# Altium project POWER_SUPPLY.PrjPcb (part 3 of 8)
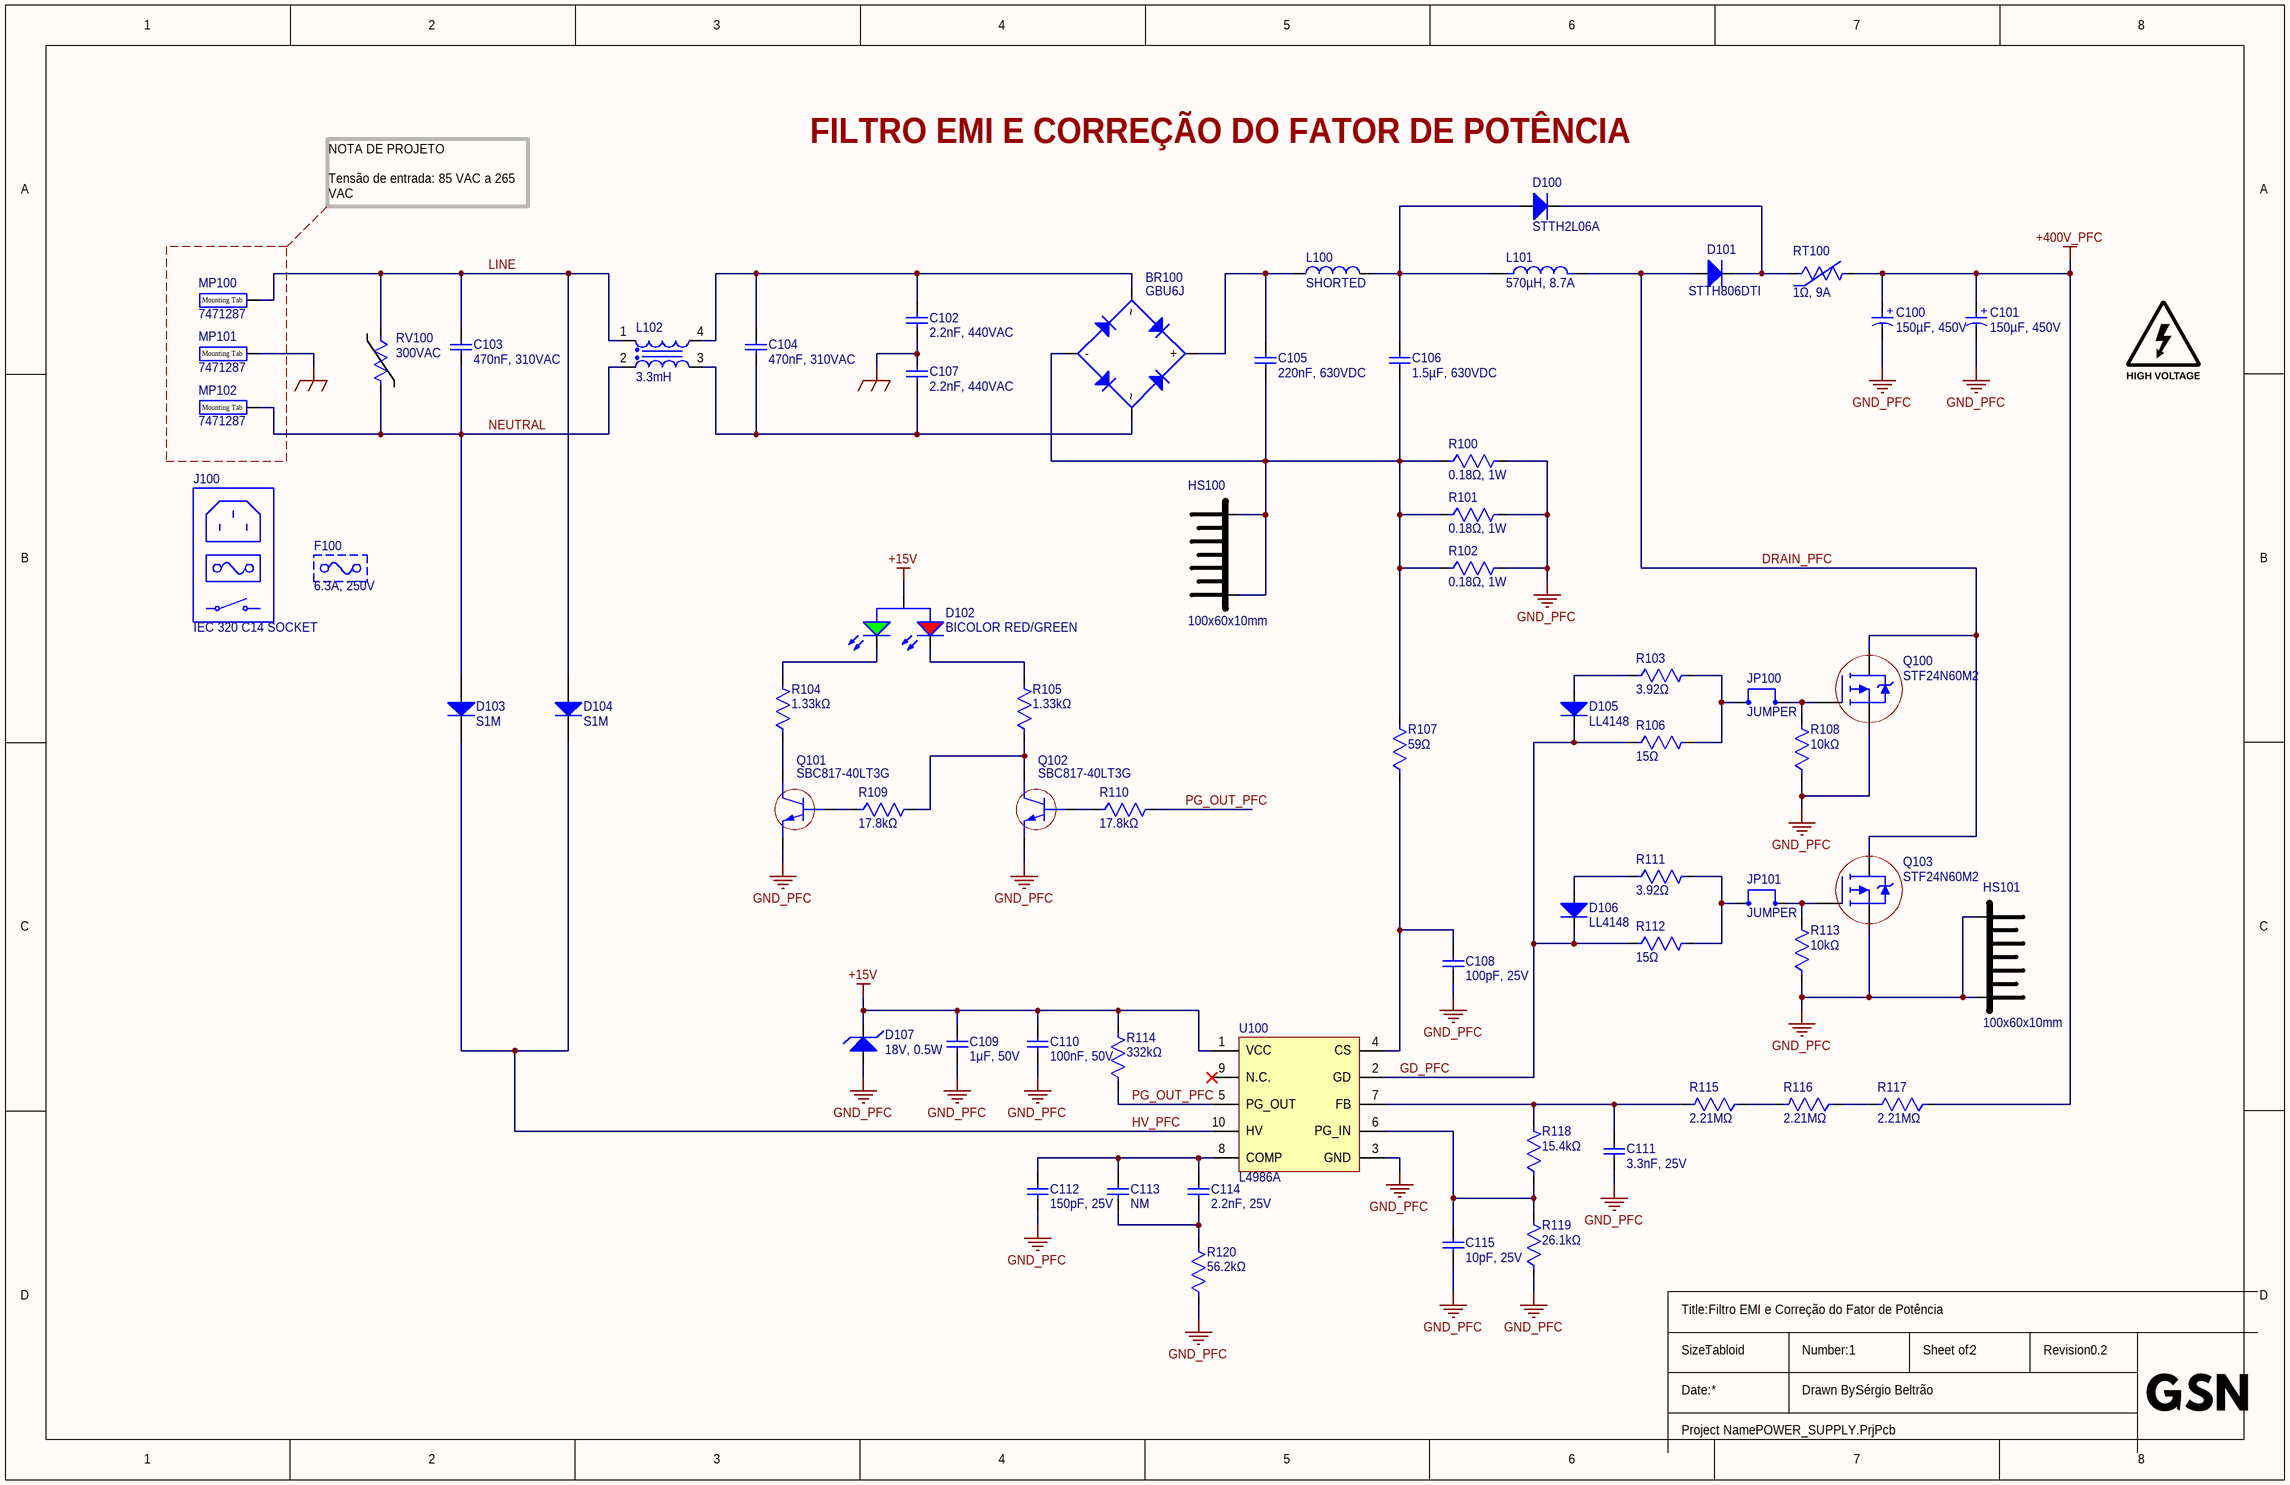
[diagram p4: 1_PFC.SchDoc]

## Sheet 1_PFC.SchDoc (continued)

### Library data of the parts (continued)
D105 D106 = LL4148: DIODE STANDARD 100V 200MA SOD80; Manufacturer: onsemi; Manufacturer Lifecycle Status: ACTIVE; Body Material: Glass; Current: 2A; Element Configuration: Single; Forward Voltage: 1V; Max Power Dissipation: 500mW; Number of Elements: 1; Peak Reverse Current: 25nA; Recovery Time: 4ns; Supplier: DigiKey; Supplier Part Number: LL4148FSCT-ND; Manufacturer Part Number: LL4148; RoHS: Compliant; Category: Rectifier Diodes; Stock: 985538; Pricing: 1=0.1, 10=0.05, 100=0.0426, 500=0.0307, 1000=0.02682 (USD); Average Rectified Current: 200mA; China RoHS: Non-Compliant; Contact Plating: Tin; Country of Origin: Mainland China; Export Control Classification Number (ECCN) Code: EAR99; Forward Current: 200mA; Height: 1.5mm; Harmonized Tariff Schedule (HTS) Code: 8541.10.00.70; Introduction Date: 2006-01-13; Lead Free: Lead Free; Length: 3.6mm; Lifecycle Status: Production; Max Forward Surge Current (Ifsm): 2A; Max Operating Temperature: 175°C; Max Output current: 200mA; Max Repetitive Reverse Voltage (Vrrm): 100V; Max Reverse Voltage (DC): 100V; Max Surge Current: 2A; Min Operating Temperature: -55°C; Mounting Technology: Surface Mount; Pins: 2; Number of Terminals: 2; Packaging: Cut Tape; Peak Non-Repetitive Surge Current: 2A; Power Dissipation: 500mW; Radiation Hardening: No; REACH SVHC: Yes; Reverse Recovery Time: 4ns; Reverse Standoff Voltage: 100V; Reverse Voltage: 100V; Schedule B: 8541100070, 8541100070|8541100070, 8541100070|8541100070|8541100070, 8541100070|8541100070|8541100070|8541100070; Voltage: 100V; Weight: 4.535924g; Width: 1.5mm; ComponentLink1URL: https://datasheet.octopart.com:443/LL4148-onsemi-datasheet-158584874.pdf?src-supplier=onsemi; ComponentLink1Description: https://datasheet.octopart.com:443/LL4148-onsemi-datasheet-158584874.pdf?src-supplier=onsemi; ComponentLink2URL: https://datasheet.octopart.com:443/LL4148-ON-Semiconductor-datasheet-85572496.pdf?src-supplier=onsemi; ComponentLink2Description: https://datasheet.octopart.com:443/LL4148-ON-Semiconductor-datasheet-85572496.pdf?src-supplier=onsemi; ComponentLink3URL: https://datasheet.octopart.com:443/LL4148-ON-Semiconductor-datasheet-86697764.pdf?src-supplier=onsemi; ComponentLink3Description: https://datasheet.octopart.com:443/LL4148-ON-Semiconductor-datasheet-86697764.pdf?src-supplier=onsemi; ComponentLink4URL: https://datasheet.octopart.com:443/LL4148-ON-Semiconductor-datasheet-17172799.pdf?src-supplier=element14+APAC; ComponentLink4Description: https://datasheet.octopart.com:443/LL4148-ON-Semiconductor-datasheet-17172799.pdf?src-supplier=element14+APAC; ComponentLink5URL: https://datasheet.octopart.com:443/LL4148-ON-Semiconductor-datasheet-86691521.pdf?src-supplier=element14+APAC; ComponentLink5Description: https://datasheet.octopart.com:443/LL4148-ON-Semiconductor-datasheet-86691521.pdf?src-supplier=element14+APAC; ComponentLink6URL: https://datasheet.octopart.com:443/LL4148-Fairchild-Semiconductor-datasheet-38581097.pdf?src-supplier=element14+APAC; ComponentLink6Description: https://datasheet.octopart.com:443/LL4148-Fairchild-Semiconductor-datasheet-38581097.pdf?src-supplier=element14+APAC; ComponentLink7URL: https://datasheet.octopart.com:443/LL4148-Fairchild-Semiconductor-datasheet-62114946.pdf?src-supplier=element14+APAC; ComponentLink7Description: https://datasheet.octopart.com:443/LL4148-Fairchild-Semiconductor-datasheet-62114946.pdf?src-supplier=element14+APAC; ComponentLink8URL: https://datasheet.octopart.com:443/LL4148-Fairchild-Semiconductor-datasheet-62292353.pdf?src-supplier=element14+APAC; ComponentLink8Description: https://datasheet.octopart.com:443/LL4148-Fairchild-Semiconductor-datasheet-62292353.pdf?src-supplier=element14+APAC; ComponentLink9URL: https://datasheet.octopart.com:443/LL4148.-ON-Semiconductor-datasheet-87455466.pdf?src-supplier=element14+APAC; ComponentLink9Description: https://datasheet.octopart.com:443/LL4148.-ON-Semiconductor-datasheet-87455466.pdf?src-supplier=element14+APAC; ComponentLink10URL: https://datasheet.octopart.com:443/LL4148-ON-Semiconductor-datasheet-100088444.pdf?src-supplier=JRH+Electronics; ComponentLink10Description: https://datasheet.octopart.com:443/LL4148-ON-Semiconductor-datasheet-100088444.pdf?src-supplier=JRH+Electronics; ComponentLink11URL: https://datasheet.octopart.com:443/LL4148-onsemi-datasheet-180961323.pdf?src-supplier=IHS; ComponentLink11Description: https://datasheet.octopart.com:443/LL4148-onsemi-datasheet-180961323.pdf?src-supplier=IHS; ComponentLink12URL: https://datasheet.octopart.com:443/LL4148-Fairchild-Semiconductor-datasheet-182297807.pdf?src-supplier=IHS; ComponentLink12Description: https://datasheet.octopart.com:443/LL4148-Fairchild-Semiconductor-datasheet-182297807.pdf?src-supplier=IHS; ComponentLink13URL: https://datasheet.octopart.com:443/LL4148-Fairchild-datasheet-492438.pdf?src-supplier=Fairchild+Semiconductor; ComponentLink13Description: https://datasheet.octopart.com:443/LL4148-Fairchild-datasheet-492438.pdf?src-supplier=Fairchild+Semiconductor; ComponentLink14URL: https://datasheet.octopart.com:443/LL4148-Fairchild-Semiconductor-datasheet-11045226.pdf?src-supplier=Fairchild+Semiconductor; ComponentLink14Description: https://datasheet.octopart.com:443/LL4148-Fairchild-Semiconductor-datasheet-11045226.pdf?src-supplier=Fairchild+Semiconductor; ComponentLink15URL: https://sigma.octopart.com:443/17344539/technical_drawing/Fairchild-Semiconductor-LL4148.pdf?src-supplier=Fairchild+Semiconductor; ComponentLink15Description: https://sigma.octopart.com:443/17344539/technical_drawing/Fairchild-Semiconductor-LL4148.pdf?src-supplier=Fairchild+Semiconductor; ComponentLink16URL: https://datasheet.octopart.com:443/LL4148-Fairchild-Semiconductor-datasheet-14041796.pdf?src-supplier=iiiC; ComponentLink16Description: https://datasheet.octopart.com:443/LL4148-Fairchild-Semiconductor-datasheet-14041796.pdf?src-supplier=iiiC; ComponentLink17URL: https://datasheet.octopart.com:443/LL4148-Fairchild-Semiconductor-datasheet-10438456.pdf?src-supplier=Jameco; ComponentLink17Description: https://datasheet.octopart.com:443/LL4148-Fairchild-Semiconductor-datasheet-10438456.pdf?src-supplier=Jameco; ComponentLink18URL: https://datasheet.octopart.com:443/LL4148-ON-Semiconductor-datasheet-81454985.pdf?src-supplier=TME; ComponentLink18Description: https://datasheet.octopart.com:443/LL4148-ON-Semiconductor-datasheet-81454985.pdf?src-supplier=TME; ComponentLink19URL: https://datasheet.octopart.com:443/LL4148-Fairchild-Semiconductor-datasheet-62139678.pdf?src-supplier=iodParts+Technologies+Inc.; ComponentLink19Description: https://datasheet.octopart.com:443/LL4148-Fairchild-Semiconductor-datasheet-62139678.pdf?src-supplier=iodParts+Technologies+Inc.; ComponentLink20URL: https://datasheet.octopart.com:443/LL4148-Fairchild-Semiconductor-datasheet-62268912.pdf?src-supplier=Newark; ComponentLink20Description: https://datasheet.octopart.com:443/LL4148-Fairchild-Semiconductor-datasheet-62268912.pdf?src-supplier=Newark; ComponentLink21URL: http://sigma.octopart.com:80/150613095/rohs_statement/ON-Semiconductor-LL4148.pdf?src-supplier=Compliance+Statements; ComponentLink21Description: http://sigma.octopart.com:80/150613095/rohs_statement/ON-Semiconductor-LL4148.pdf?src-supplier=Compliance+Statements; ComponentLink22URL: http://sigma.octopart.com:80/17353531/reach_statement/Fairchild-Semiconductor-LL4148.pdf?src-supplier=Compliance+Statements; ComponentLink22Description: http://sigma.octopart.com:80/17353531/reach_statement/Fairchild-Semiconductor-LL4148.pdf?src-supplier=Compliance+Statements; ComponentLink23URL: http://sigma.octopart.com:80/17353532/materials_sheet/Fairchild-Semiconductor-LL4148.pdf?src-supplier=Compliance+Statements; ComponentLink23Description: http://sigma.octopart.com:80/17353532/materials_sheet/Fairchild-Semiconductor-LL4148.pdf?src-supplier=Compliance+Statements; ComponentLink24URL: http://sigma.octopart.com:80/33193297/reach_statement/Fairchild-Semiconductor-LL4148.pdf?src-supplier=Compliance+Statements; ComponentLink24Description: http://sigma.octopart.com:80/33193297/reach_statement/Fairchild-Semiconductor-LL4148.pdf?src-supplier=Compliance+Statements; ComponentLink25URL: http://sigma.octopart.com:80/33193298/materials_sheet/Fairchild-Semiconductor-LL4148.pdf?src-supplier=Compliance+Statements; ComponentLink25Description: http://sigma.octopart.com:80/33193298/materials_sheet/Fairchild-Semiconductor-LL4148.pdf?src-supplier=Compliance+Statements; ComponentLink26URL: http://sigma.octopart.com:80/reach_statement/ON-Semiconductor-company-79.pdf?src-supplier=Compliance+Statements; ComponentLink26Description: http://sigma.octopart.com:80/reach_statement/ON-Semiconductor-company-79.pdf?src-supplier=Compliance+Statements; ComponentLink27URL: http://sigma.octopart.com:80/rohs_statement/Fairchild-Semiconductor-company-11.pdf?src-supplier=Compliance+Statements; ComponentLink27Description: http://sigma.octopart.com:80/rohs_statement/Fairchild-Semiconductor-company-11.pdf?src-supplier=Compliance+Statements; ComponentLink28URL: http://sigma.octopart.com:80/rohs_statement/Fairchild-Semiconductor-company-10.pdf?src-supplier=Compliance+Statements; ComponentLink28Description: http://sigma.octopart.com:80/rohs_statement/Fairchild-Semiconductor-company-10.pdf?src-supplier=Compliance+Statements; ComponentLink29URL: http://sigma.octopart.com:80/reach_statement/Fairchild-Semiconductor-company-9.pdf?src-supplier=Compliance+Statements; ComponentLink29Description: http://sigma.octopart.com:80/reach_statement/Fairchild-Semiconductor-company-9.pdf?src-supplier=Compliance+Statements; ComponentLink30URL: https://octopart.com:443/opatz8j6/c1?t=Xpxkz2NEgx4OvPA3Qtyl6iXlCaTO6Dx006tOayOQh8UpEakiw79qybXVjaLUkLdsDcwAhzZWzx4hsVWPp7VVSRUS2jTBS-XM3DH5FBRSfylGBMniz7AQVr_Q7R3Jx2l4jaOKMfh2pC0Sl6mKcG5iyxqYHFtscphSICSNicIjKzxGRZvfLlKmxXOW-H294Yk1x_cmMiAGYKmeAx8dFNplOshOoCdbbUeOktIk3E71qjxJoHCVKROfEgPEuVAOotDk7D3GLFhb0ONIF7lvGKCN4-I4pNAMnSjDC8dGdI9FUWqMmgWXOVngnCQl4h9fXjZD62hPSik3c7L-oytIjEzlRkn8LqxphGg_pA&src-supplier=Compliance+Statements; ComponentLink30Description: https://octopart.com:443/opatz8j6/c1?t=Xpxkz2NEgx4OvPA3Qtyl6iXlCaTO6Dx006tOayOQh8UpEakiw79qybXVjaLUkLdsDcwAhzZWzx4hsVWPp7VVSRUS2jTBS-XM3DH5FBRSfylGBMniz7AQVr_Q7R3Jx2l4jaOKMfh2pC0Sl6mKcG5iyxqYHFtscphSICSNicIjKzxGRZvfLlKmxXOW-H294Yk1x_cmMiAGYKmeAx8dFNplOshOoCdbbUeOktIk3E71qjxJoHCVKROfEgPEuVAOotDk7D3GLFhb0ONIF7lvGKCN4-I4pNAMnSjDC8dGdI9FUWqMmgWXOVngnCQl4h9fXjZD62hPSik3c7L-oytIjEzlRkn8LqxphGg_pA&src-supplier=Compliance+Statements; ComponentLink31URL: https://octopart.com:443/opatz8j6/c1?t=tFIoAttQBStIyOR12NpmeKiMmTe5SP8-8Xq4lkvK6p_Vq1o_9olfxB33t-2EuHG15KFq_ggm6QlYiEY221wMJCkD3umFHElGgHs0hHZS39-Qp2ZZRsupO9Hr1N3PAdDpe750FQU0XgmhgEwHMZn8Z3k5HuoWmRNpRKEnkRFrE0IXKj6CmvQTfQmsENA-D1Qdyo8uqC6uxEsjmMW0Z_q8gXSjLM0_5fRz8eR6DFUS172wwd2S-tXcH_fY0j82uyAjy2XTX7JZakjtcfcCauvyxulJf2m4Pvazm22R5r_wpz6eRhj7z7PQ5lP7HSMDztpbFG7UgPSC_-QkyDNCFsHVILyjtZbhab6GOQU&src-supplier=Compliance+Statements; ComponentLink31Description: https://octopart.com:443/opatz8j6/c1?t=tFIoAttQBStIyOR12NpmeKiMmTe5SP8-8Xq4lkvK6p_Vq1o_9olfxB33t-2EuHG15KFq_ggm6QlYiEY221wMJCkD3umFHElGgHs0hHZS39-Qp2ZZRsupO9Hr1N3PAdDpe750FQU0XgmhgEwHMZn8Z3k5HuoWmRNpRKEnkRFrE0IXKj6CmvQTfQmsENA-D1Qdyo8uqC6uxEsjmMW0Z_q8gXSjLM0_5fRz8eR6DFUS172wwd2S-tXcH_fY0j82uyAjy2XTX7JZakjtcfcCauvyxulJf2m4Pvazm22R5r_wpz6eRhj7z7PQ5lP7HSMDztpbFG7UgPSC_-QkyDNCFsHVILyjtZbhab6GOQU&src-supplier=Compliance+Statements
D107 = ZMM18B: DIODE ZENER 18V 500MW SOD80C; Manufacturer: Diotec; Manufacturer Lifecycle Status: ACTIVE; Body Material: Glass; Impedance: 50Ω; Number of Elements: 1; Peak Reverse Current: 100nA; Polarity: Unidirectional; Reverse Standoff Voltage: 13V; Voltage Tolerance: 2%; Zener Current: 5mA; Supplier: DigiKey; Supplier Part Number: 4878-ZMM18B-ND; Manufacturer Part Number: ZMM18B; RoHS: Compliant; Category: Zener Diodes; Stock: 2500; Pricing: 1=0.18, 10=0.108, 100=0.0823, 500=0.07154, 1000=0.042, 2500=0.04116 (USD); Country of Origin: Mainland China; Export Control Classification Number (ECCN) Code: EAR99; Harmonized Tariff Schedule (HTS) Code: 85411000; Introduction Date: 2005-07-18; Lifecycle Status: Production; Max Operating Temperature: 175°C; Max Power Dissipation: 500mW; Min Operating Temperature: -50°C; Number of Terminals: 2; REACH SVHC: Unknown; Reference Voltage: 18V; Weight: 49mg; ComponentLink1URL: https://datasheet.octopart.com:443/ZMM18B-Diotec-datasheet-168810322.pdf?src-supplier=IHS; ComponentLink1Description: https://datasheet.octopart.com:443/ZMM18B-Diotec-datasheet-168810322.pdf?src-supplier=IHS; ComponentLink2URL: https://datasheet.octopart.com:443/ZMM18B-Diotec-datasheet-20772213.pdf?src-supplier=Component+Distributors+Inc.; ComponentLink2Description: https://datasheet.octopart.com:443/ZMM18B-Diotec-datasheet-20772213.pdf?src-supplier=Component+Distributors+Inc.; ComponentLink3URL: https://datasheet.octopart.com:443/ZMM18B-Diotec-datasheet-113245526.pdf?src-supplier=TME; ComponentLink3Description: https://datasheet.octopart.com:443/ZMM18B-Diotec-datasheet-113245526.pdf?src-supplier=TME; ComponentLink4URL: https://datasheet.octopart.com:443/ZMM18B-Diotec-datasheet-177062540.pdf?src-supplier=Burklin+Elektronik; ComponentLink4Description: https://datasheet.octopart.com:443/ZMM18B-Diotec-datasheet-177062540.pdf?src-supplier=Burklin+Elektronik
F100 = 0652C6300-11: FUSE GLASS 6.3A 250VAC 5X20MM; Manufacturer: Bel Fuse; Supplier: DigiKey; Supplier Part Number: 5923-0652C6300-11-ND; Manufacturer Part Number: 0652C6300-11; RoHS: Compliant; Category: Fuses; Stock: 939; Pricing: 1=0.7, 5=0.578, 10=0.533, 50=0.4422, 100=0.408, 250=0.36672, 500=0.33824, 1000=0.31188, 5000=0.25785 (USD); China RoHS: Compliant; Current Rating: 6.3A; Export Control Classification Number (ECCN) Code: EAR99; Height: 20mm; Introduction Date: 2024-09-20; Length: 5mm; Lifecycle Status: Production; Max Operating Temperature: 125°C; Min Operating Temperature: -55°C; Packaging: Bulk; REACH SVHC: Yes; Voltage Rating (AC): 250V; ComponentLink1URL: https://datasheet.octopart.com:443/0652C6300-11-Bel-Fuse-datasheet-183197481.pdf?src-supplier=Electro+Sonic; ComponentLink1Description: https://datasheet.octopart.com:443/0652C6300-11-Bel-Fuse-datasheet-183197481.pdf?src-supplier=Electro+Sonic
GRPH100 = DANGER HIGH VOLTAGE ICON: GRAPHIC ICON
HS100 HS101 = GENERIC-HEATSINK-100X60X10MM: GENERIC HEATSINK 100X60X10MM; Manufacturer: OEM; Manufacturer Part Number: None
J100 = AC-01B-1: Manufacturer: OEM; Manufacturer Part Number: AC-01B-1
JP100 JP101 = JUMPER-TX-8P2X1P5MM-WHITE: JUMPER SMD TX 8.2X1.5MM WHITE; Manufacturer: OEM; Manufacturer Part Number: None
L100 = 7447070: WE-FI THT Leaded Toroidal Line Choke, 100uH, 6A, 0.035Ohm; Manufacturer: Wurth Elektronik; Manufacturer Part Number: 7447070; Category: Filter Chokes; Match Code: WE-FI; ComponentLink1Description: Website Link; ComponentLink1URL: https://www.we-online.com/redexpert/article/7447070?ad; ComponentLink2Description: Datasheet Link; ComponentLink2URL: https://www.we-online.com/redexpert/spec/7447070?ad; Mount: Through Hole; Operating Temperature Min: -40°C; Operating Temperature Max: 105°C; Packaging: Tray; Length: 25mm; Width: 11.5mm; Height: 25mm; DC Resistance Max: 0.035Ohm; Inductance: 100uH; Rated Current: 6A
L101 = MMTR014901: FIXED IND 570UH 8.7A 65MOHM KOOL MU CORE; Manufacturer: Legrand; Value: 570µH; Supplier: Display Max Eletrônica; Manufacturer Part Number: MMTR014901
L102 = 7448256033: WE-CMB Common Mode Power Line Choke, THT, Type XL, 3.3mH, 6A, 25mΩ; Manufacturer: Wurth Elektronik; Case/Size Code: Type XL; Insulation Test Voltage: 1500VAC; Material: MnZn; Rated Voltage (AC): 250V; Manufacturer Part Number: 7448256033; Category: Common Mode Chokes; Match Code: WE-CMB; ComponentLink1Description: Website Link; ComponentLink1URL: https://www.we-online.com/redexpert/article/7448256033?ad; ComponentLink2Description: Datasheet Link; ComponentLink2URL: https://www.we-online.com/redexpert/spec/7448256033?ad; Mount: Through Hole; Operating Temperature Min: -40°C; Operating Temperature Max: 125°C; Packaging: Carton; Length: 30mm; Width: 21mm; Height: 35mm; DC Resistance Max: 25mΩ; Inductance: 3.3mH; Rated Current: 6A
MP100-MP102 = 7471287: WA-MTAB Mounting Tab, THT, Vertical, Male, Blade 6.35mm; Manufacturer: Wurth Elektronik; Manufacturer Part Number: 7471287; Category: Mounting Tabs; Match Code: WA-MTAB; ComponentLink1Description: Website Link; ComponentLink1URL: https://www.we-online.com/redexpert/article/7471287?ad; ComponentLink2Description: Datasheet Link; ComponentLink2URL: https://www.we-online.com/redexpert/spec/7471287?ad; Mount: Through Hole; Operating Temperature Min: -55°C; Operating Temperature Max: 150°C; Packaging: Bag; Blade Design: 6.35mm; Gender: Male; Orientation: Vertical
Q100 Q103 = STF24N60M2: MOSFET N-CH 600V 18A TO220FP; Manufacturer: STMicroelectronics; Drain to Source Resistance: 190mΩ; Element Configuration: Single; Fall Time: 61ns; Gate to Source Voltage (Vgs): 25V; Input Capacitance: 1.06nF; Max Power Dissipation: 30W; Number of Elements: 1; Rise Time: 9ns; Turn-Off Delay Time: 60ns; Turn-On Delay Time: 14ns; Supplier: DigiKey; Supplier Part Number: 497-13577-5-ND; Manufacturer Part Number: STF24N60M2; RoHS: Compliant; Category: MOSFETs; Stock: 871; Pricing: 1=3.33, 50=1.6716, 100=1.5103, 500=1.22756, 1000=1.13672, 2000=1.06037, 5000=1.05788 (USD); Case/Package: TO-220-3; China RoHS: Non-Compliant; Continuous Drain Current (ID): 18A; Country of Origin: Mainland China; Drain to Source Breakdown Voltage: 600V; Drain to Source Voltage (Vdss): 600V; Export Control Classification Number (ECCN) Code: EAR99; Height: 16.4mm; Introduction Date: 2013-01-14; Lead Free: Lead Free; Length: 10.4mm; Lifecycle Status: Production; Max Operating Temperature: 150°C; Min Breakdown Voltage: 600V; Min Operating Temperature: -55°C; Mounting Technology: Through Hole; Pins: 3; Number of Terminals: 3; Power Dissipation: 30W; Radiation Hardening: No; Rds On Max: 190mΩ; REACH SVHC: No; Schedule B: 8541290080, 8541290080|8541290080|8541290080|8541290080|8541290080|8541290080|8541290080|8541290080|8541290080|8541290080|8541290080|8541290080|8541290080|8541290080|8541290080|8541290080|8541290080|8541290080|8541290080|8541290080|8541290080|8541290080|8541290080|85; Width: 4.6mm; ComponentLink1URL: https://datasheet.octopart.com:443/STF24N60M2-STMicroelectronics-datasheet-62336145.pdf?src-supplier=Farnell; ComponentLink1Description: https://datasheet.octopart.com:443/STF24N60M2-STMicroelectronics-datasheet-62336145.pdf?src-supplier=Farnell; ComponentLink2URL: https://datasheet.octopart.com:443/STF24N60M2-STMicroelectronics-datasheet-16349054.pdf?src-supplier=Future+Electronics; ComponentLink2Description: https://datasheet.octopart.com:443/STF24N60M2-STMicroelectronics-datasheet-16349054.pdf?src-supplier=Future+Electronics; ComponentLink3URL: https://datasheet.octopart.com:443/STF24N60M2-STMicroelectronics-datasheet-62335173.pdf?src-supplier=TME; ComponentLink3Description: https://datasheet.octopart.com:443/STF24N60M2-STMicroelectronics-datasheet-62335173.pdf?src-supplier=TME
Q101 Q102 = SBC817-40LT3G: TRANS NPN 45V 0.5A SOT23-3; Manufacturer: onsemi; Manufacturer Lifecycle Status: ACTIVE; Collector Base Voltage (VCBO): 50V; Continuous Collector Current: 500mA; Element Configuration: Single; Emitter Base Voltage (VEBO): 5V; Frequency: 100MHz; hFE Min: 250; Max Power Dissipation: 300mW; Number of Elements: 1; Supplier: DigiKey; Supplier Part Number: SBC817-40LT3GOSCT-ND; Manufacturer Part Number: SBC817-40LT3G; RoHS: Compliant; Category: BJTs; Stock: 144045; Pricing: 1=0.24, 10=0.146, 100=0.0904, 500=0.06616, 1000=0.05829, 2000=0.05165, 5000=0.04443 (USD); Case/Package: SOT-23-3; China RoHS: Compliant; Collector Emitter Breakdown Voltage: 45V; Collector Emitter Voltage (VCEO): 45V; Country of Origin: Mainland China; Export Control Classification Number (ECCN) Code: EAR99; Halogen Free: Halogen Free; Introduction Date: 1991-03-01; Lead Free: Lead Free; Lifecycle Status: Production; Max Breakdown Voltage: 45V; Max Collector Current: 500mA; Clock Frequency: 100MHz; Max Operating Temperature: 150°C; Min Operating Temperature: -55°C; Pins: 3; Number of Terminals: 3; Packaging: Tape and Reel; Polarity: NPN; Power Dissipation: 300mW; Radiation Hardening: No; REACH SVHC: Yes; Schedule B: 8541210080, 8541210080|8541210080, 8541210080|8541210080|8541210080, 8541210080|8541210080|8541210080|8541210080; Transition Frequency: 100MHz; ComponentLink1URL: https://datasheet.octopart.com:443/SBC817-40LT3G-onsemi-datasheet-175914671.pdf?src-supplier=IHS; ComponentLink1Description: https://datasheet.octopart.com:443/SBC817-40LT3G-onsemi-datasheet-175914671.pdf?src-supplier=IHS; ComponentLink2URL: https://datasheet.octopart.com:443/SBC817-40LT3G-ON-Semiconductor-datasheet-11547464.pdf?src-supplier=Upverter; ComponentLink2Description: https://datasheet.octopart.com:443/SBC817-40LT3G-ON-Semiconductor-datasheet-11547464.pdf?src-supplier=Upverter; ComponentLink3URL: https://datasheet.octopart.com:443/SBC817-40LT3G-ON-Semiconductor-datasheet-78758879.pdf?src-supplier=Master+Electronics; ComponentLink3Description: https://datasheet.octopart.com:443/SBC817-40LT3G-ON-Semiconductor-datasheet-78758879.pdf?src-supplier=Master+Electronics; ComponentLink4URL: https://datasheet.octopart.com:443/SBC817-40LT3G-onsemi-datasheet-189132499.pdf?src-supplier=Master+Electronics; ComponentLink4Description: https://datasheet.octopart.com:443/SBC817-40LT3G-onsemi-datasheet-189132499.pdf?src-supplier=Master+Electronics; ComponentLink5URL: https://datasheet.octopart.com:443/SBC817-40LT3G-ON-Semiconductor-datasheet-8110464.pdf?src-supplier=onsemi; ComponentLink5Description: https://datasheet.octopart.com:443/SBC817-40LT3G-ON-Semiconductor-datasheet-8110464.pdf?src-supplier=onsemi; ComponentLink6URL: https://datasheet.octopart.com:443/SBC817-40LT3G-ON-Semiconductor-datasheet-6400296.pdf?src-supplier=onsemi; ComponentLink6Description: https://datasheet.octopart.com:443/SBC817-40LT3G-ON-Semiconductor-datasheet-6400296.pdf?src-supplier=onsemi; ComponentLink7URL: https://datasheet.octopart.com:443/SBC817-40LT3G-onsemi-datasheet-133521192.pdf?src-supplier=TME; ComponentLink7Description: https://datasheet.octopart.com:443/SBC817-40LT3G-onsemi-datasheet-133521192.pdf?src-supplier=TME; ComponentLink8URL: http://sigma.octopart.com:80/15540786/rohs_certificate/ON-Semiconductor-SBC817-40LT3G.pdf?src-supplier=Compliance+Statements; ComponentLink8Description: http://sigma.octopart.com:80/15540786/rohs_certificate/ON-Semiconductor-SBC817-40LT3G.pdf?src-supplier=Compliance+Statements; ComponentLink9URL: http://sigma.octopart.com:80/15684525/materials_sheet/ON-Semiconductor-SBC817-40LT3G.csv?src-supplier=Compliance+Statements; ComponentLink9Description: http://sigma.octopart.com:80/15684525/materials_sheet/ON-Semiconductor-SBC817-40LT3G.csv?src-supplier=Compliance+Statements; ComponentLink10URL: http://sigma.octopart.com:80/150631289/rohs_statement/ON-Semiconductor-SBC817-40LT3G.pdf?src-supplier=Compliance+Statements; ComponentLink10Description: http://sigma.octopart.com:80/150631289/rohs_statement/ON-Semiconductor-SBC817-40LT3G.pdf?src-supplier=Compliance+Statements; ComponentLink11URL: http://sigma.octopart.com:80/reach_statement/ON-Semiconductor-company-79.pdf?src-supplier=Compliance+Statements; ComponentLink11Description: http://sigma.octopart.com:80/reach_statement/ON-Semiconductor-company-79.pdf?src-supplier=Compliance+Statements; ComponentLink12URL: https://octopart.com:443/opatz8j6/c1?t=cEC30QwZsyb0x-FMX1jhecc8cj0lODbyQVaJL5I4EOudI-i4uiyo8QJe7x8WGpb_UfldyhXdI6wTsOpeJ5HWz7Kzleo1EiYpUhSwBawIenFlUCJsMQESd9nlIcVrbvWrabnb6HpXCtvxDkswRDKZDOG3MBWymJDy-mDPZ7u5UlptsX8-ONvWANeBowi-w7nz9iZWLyjqVoM_QTKEQgTILpDidA8CXVyMync_ukwLaadxciX7hbgDafM4N20bPQPEg7z2Sm1KwG15cEibpJqtQ1hKuQpn-edZc_o2ddvdnsTvT3gddPA_45tVxaNa9XWOJj00WFdTbgFSlU6TTFEybWVRRlK52823bHwN5uVZ-7M&src-supplier=Compliance+Statements; ComponentLink12Description: https://octopart.com:443/opatz8j6/c1?t=cEC30QwZsyb0x-FMX1jhecc8cj0lODbyQVaJL5I4EOudI-i4uiyo8QJe7x8WGpb_UfldyhXdI6wTsOpeJ5HWz7Kzleo1EiYpUhSwBawIenFlUCJsMQESd9nlIcVrbvWrabnb6HpXCtvxDkswRDKZDOG3MBWymJDy-mDPZ7u5UlptsX8-ONvWANeBowi-w7nz9iZWLyjqVoM_QTKEQgTILpDidA8CXVyMync_ukwLaadxciX7hbgDafM4N20bPQPEg7z2Sm1KwG15cEibpJqtQ1hKuQpn-edZc_o2ddvdnsTvT3gddPA_45tVxaNa9XWOJj00WFdTbgFSlU6TTFEybWVRRlK52823bHwN5uVZ-7M&src-supplier=Compliance+Statements; ComponentLink13URL: https://octopart.com:443/opatz8j6/c1?t=zgMoQUE-FAGizIL2uNADbP3CQfJXduVKNLOt0cT-C7XNOnl5EOgq1b4UVzb0SZjomH3a3CKF513mPEsnVuWFTldNModuoiOAROM-U7UMjU1TiA4JeYDoVNfia-psQDQPr2NtqLaOU9Ju06PrsXVFYjz3NjgsSVJa-5X9CcWQ1HPxPGGUjhKccWy9QJVPTcefUdorkFOZvdb3XFmpP_42jgzyR9ZUQAURqjwANTg96Z5ittV_NTML0IEyFPhh0jLh0am3ICJpb8VA9ph6AsqLc9j4fhdilqUiQTpG4UGLijUcgX0mpfEUR-9G0JRIiKjoFhJPWB3BEKd5JcwsK41biiNJ-0hjTcgtgsqlWYFFTPLS&src-supplier=Compliance+Statements; ComponentLink13Description: https://octopart.com:443/opatz8j6/c1?t=zgMoQUE-FAGizIL2uNADbP3CQfJXduVKNLOt0cT-C7XNOnl5EOgq1b4UVzb0SZjomH3a3CKF513mPEsnVuWFTldNModuoiOAROM-U7UMjU1TiA4JeYDoVNfia-psQDQPr2NtqLaOU9Ju06PrsXVFYjz3NjgsSVJa-5X9CcWQ1HPxPGGUjhKccWy9QJVPTcefUdorkFOZvdb3XFmpP_42jgzyR9ZUQAURqjwANTg96Z5ittV_NTML0IEyFPhh0jLh0am3ICJpb8VA9ph6AsqLc9j4fhdilqUiQTpG4UGLijUcgX0mpfEUR-9G0JRIiKjoFhJPWB3BEKd5JcwsK41biiNJ-0hjTcgtgsqlWYFFTPLS&src-supplier=Compliance+Statements
R100-R102 = RL2512FK-070R18L: RES 0.18 OHM 1% 1W 2512; Manufacturer: Yageo Group; Value: 180mΩ; Temperature Coefficient: 600ppm/°C; Working Voltage: 424.3mV; Supplier: DigiKey; Supplier Part Number: 311-0.18TCT-ND; Manufacturer Part Number: RL2512FK-070R18L; RoHS: Compliant; Category: Chip SMD Resistors; Stock: 7929; Pricing: 1=0.44, 10=0.249, 25=0.206, 50=0.1814, 100=0.1618, 250=0.142, 500=0.13056, 1000=0.12148 (USD); Case/Package: 2512; Case Code (Imperial): 2512; Case Code (Metric): 6332; China RoHS: Non-Compliant; Composition: Thick Film; Contact Plating: Tin; Depth: 3.2mm; Height: 550µm; Lead Free: Lead Free; Length: 6.35mm; Lifecycle Status: Production; Max Operating Temperature: 155°C; Military Standard: Not; Min Operating Temperature: -55°C; Mounting Technology: Surface Mount; Number of Terminals: 2; Packaging: Cut Tape; Power Rating: 1W; Radiation Hardening: No; Ratings: AEC-Q200; REACH SVHC: Yes; Schedule B: 8533210045, 8533210045|8533210045, 8533210045|8533210045|8533210045, 8533210045|8533210045|8533210045|8533210045; Termination: SMD/SMT; Tolerance: 1%; Weight: 40.511469mg; Width: 3.2mm; ComponentLink1URL: https://datasheet.octopart.com:443/RL2512FK-070R18L-Yageo-datasheet-182189623.pdf?src-supplier=Newark; ComponentLink1Description: https://datasheet.octopart.com:443/RL2512FK-070R18L-Yageo-datasheet-182189623.pdf?src-supplier=Newark; ComponentLink2URL: https://datasheet.octopart.com:443/RL2512FK-070R18L-Yageo-datasheet-8324393.pdf?src-supplier=Newark; ComponentLink2Description: https://datasheet.octopart.com:443/RL2512FK-070R18L-Yageo-datasheet-8324393.pdf?src-supplier=Newark; ComponentLink3URL: https://datasheet.octopart.com:443/RL2512FK-070R18L-Yageo-datasheet-62330055.pdf?src-supplier=element14+APAC; ComponentLink3Description: https://datasheet.octopart.com:443/RL2512FK-070R18L-Yageo-datasheet-62330055.pdf?src-supplier=element14+APAC; ComponentLink4URL: https://datasheet.octopart.com/RL2512FK-070R18L-Yageo-datasheet-10916029.pdf; ComponentLink4Description: https://datasheet.octopart.com/RL2512FK-070R18L-Yageo-datasheet-10916029.pdf; ComponentLink5URL: https://datasheet.octopart.com:443/RL2512FK-070R18L-Yageo-datasheet-178203169.pdf?src-supplier=Future+Electronics; ComponentLink5Description: https://datasheet.octopart.com:443/RL2512FK-070R18L-Yageo-datasheet-178203169.pdf?src-supplier=Future+Electronics; ComponentLink6URL: https://datasheet.octopart.com:443/RL2512FK-070R18L-Yageo-datasheet-83209227.pdf?src-supplier=Future+Electronics; ComponentLink6Description: https://datasheet.octopart.com:443/RL2512FK-070R18L-Yageo-datasheet-83209227.pdf?src-supplier=Future+Electronics; ComponentLink7URL: https://datasheet.octopart.com:443/RL2512FK-070R18L-Yageo-datasheet-137700928.pdf?src-supplier=Future+Electronics; ComponentLink7Description: https://datasheet.octopart.com:443/RL2512FK-070R18L-Yageo-datasheet-137700928.pdf?src-supplier=Future+Electronics; ComponentLink8URL: https://datasheet.octopart.com:443/RL2512FK-070R18L-Yageo-datasheet-62044473.pdf?src-supplier=Future+Electronics; ComponentLink8Description: https://datasheet.octopart.com:443/RL2512FK-070R18L-Yageo-datasheet-62044473.pdf?src-supplier=Future+Electronics; ComponentLink9URL: https://datasheet.octopart.com:443/RL2512FK-070R18L-Yageo-datasheet-61253474.pdf?src-supplier=Future+Electronics; ComponentLink9Description: https://datasheet.octopart.com:443/RL2512FK-070R18L-Yageo-datasheet-61253474.pdf?src-supplier=Future+Electronics; ComponentLink10URL: https://datasheet.octopart.com:443/RL2512FK-070R18L-Yageo-datasheet-60483056.pdf?src-supplier=Future+Electronics; ComponentLink10Description: https://datasheet.octopart.com:443/RL2512FK-070R18L-Yageo-datasheet-60483056.pdf?src-supplier=Future+Electronics; ComponentLink11URL: http://sigma.octopart.com:80/conflict_mineral_statement/Yageo-company-3.pdf?src-supplier=Compliance+Statements; ComponentLink11Description: http://sigma.octopart.com:80/conflict_mineral_statement/Yageo-company-3.pdf?src-supplier=Compliance+Statements; ComponentLink12URL: http://sigma.octopart.com:80/rohs_statement/Yageo-company-2.pdf?src-supplier=Compliance+Statements; ComponentLink12Description: http://sigma.octopart.com:80/rohs_statement/Yageo-company-2.pdf?src-supplier=Compliance+Statements
R103 R111 = RC0805FR-073R92L: RES 3.92 OHM 1% 1/8W 0805; Manufacturer: Yageo Group; Manufacturer Package Identifier: 0805 (2012 metric); Max Power Dissipation: 125mW; Temperature Coefficient: 200ppm/°C; Voltage Rating: 150V; Supplier: DigiKey; Supplier Part Number: 311-3.92CRCT-ND; Manufacturer Part Number: RC0805FR-073R92L; RoHS: Compliant; Category: Chip SMD Resistors; Stock: 8839; Pricing: 1=0.1, 10=0.015, 25=0.0148 (USD); Case/Package: 0805; Case Code (Imperial): 0805; China RoHS: Non-Compliant; Composition: Thick Film; Contact Plating: Tin; Depth: 1.25mm; Features: Moisture Resistant; Height: 500µm; Lead Free: Lead Free; Length: 2mm; Lifecycle Status: Production; Max Operating Temperature: 155°C; Military Standard: Not; Min Operating Temperature: -55°C; Mounting Technology: Surface Mount; Number of Terminals: 2; Number of Terminations: 2; Power Dissipation: 125mW; Power Rating: 125mW; Radiation Hardening: No; REACH SVHC: Yes; Value: 3.92Ω; Schedule B: 8533210045, 8533210045|8533210045|8533210045|8533210045|8533210045; Termination: SMD/SMT; Tolerance: 1%; Voltage Rating (DC): 150V; Width: 1.25mm; Working Voltage: 150V; ComponentLink1URL: https://datasheet.octopart.com:443/RC0805FR-073R92L-Yageo-datasheet-175887523.pdf?src-supplier=IHS; ComponentLink1Description: https://datasheet.octopart.com:443/RC0805FR-073R92L-Yageo-datasheet-175887523.pdf?src-supplier=IHS; ComponentLink2URL: https://datasheet.octopart.com:443/RC0805FR-073R92L-Yageo-datasheet-103092701.pdf?src-supplier=Upverter; ComponentLink2Description: https://datasheet.octopart.com:443/RC0805FR-073R92L-Yageo-datasheet-103092701.pdf?src-supplier=Upverter; ComponentLink3URL: https://datasheet.octopart.com:443/RC0805FR-073R92L-Yageo-Group-datasheet-176638170.pdf?src-supplier=Future+Electronics; ComponentLink3Description: https://datasheet.octopart.com:443/RC0805FR-073R92L-Yageo-Group-datasheet-176638170.pdf?src-supplier=Future+Electronics; ComponentLink4URL: https://datasheet.octopart.com:443/RC0805FR-073R92L-Yageo-datasheet-164759695.pdf?src-supplier=Future+Electronics; ComponentLink4Description: https://datasheet.octopart.com:443/RC0805FR-073R92L-Yageo-datasheet-164759695.pdf?src-supplier=Future+Electronics; ComponentLink5URL: https://datasheet.octopart.com:443/RC0805FR-073R92L-Yageo-datasheet-12592811.pdf?src-supplier=Future+Electronics; ComponentLink5Description: https://datasheet.octopart.com:443/RC0805FR-073R92L-Yageo-datasheet-12592811.pdf?src-supplier=Future+Electronics; ComponentLink6URL: https://datasheet.octopart.com:443/RC0805FR-073R92L-Yageo-datasheet-8330313.pdf?src-supplier=Future+Electronics; ComponentLink6Description: https://datasheet.octopart.com:443/RC0805FR-073R92L-Yageo-datasheet-8330313.pdf?src-supplier=Future+Electronics; ComponentLink7URL: https://datasheet.octopart.com:443/RC0805FR-073R92L-Yageo-datasheet-8324252.pdf?src-supplier=Future+Electronics; ComponentLink7Description: https://datasheet.octopart.com:443/RC0805FR-073R92L-Yageo-datasheet-8324252.pdf?src-supplier=Future+Electronics; ComponentLink8URL: https://datasheet.octopart.com/RC0805FR-073R92L-Yageo-datasheet-73766026.pdf; ComponentLink8Description: https://datasheet.octopart.com/RC0805FR-073R92L-Yageo-datasheet-73766026.pdf; ComponentLink9URL: https://datasheet.octopart.com:443/RC0805FR-073R92L-Yageo-datasheet-118657.pdf?src-supplier=DigiKey; ComponentLink9Description: https://datasheet.octopart.com:443/RC0805FR-073R92L-Yageo-datasheet-118657.pdf?src-supplier=DigiKey; ComponentLink10URL: http://sigma.octopart.com:80/conflict_mineral_statement/Yageo-company-3.pdf?src-supplier=Compliance+Statements; ComponentLink10Description: http://sigma.octopart.com:80/conflict_mineral_statement/Yageo-company-3.pdf?src-supplier=Compliance+Statements; ComponentLink11URL: http://sigma.octopart.com:80/rohs_statement/Yageo-company-2.pdf?src-supplier=Compliance+Statements; ComponentLink11Description: http://sigma.octopart.com:80/rohs_statement/Yageo-company-2.pdf?src-supplier=Compliance+Statements
R104 R105 = RC1206FR-071K33L: RES 1.33K OHM 1% 1/4W 1206; Manufacturer: Yageo Group; Power Rating: 250mW; Temperature Coefficient: 100ppm/°C; Voltage Rating: 200V; Supplier: DigiKey; Supplier Part Number: 311-1.33KFRCT-ND; Manufacturer Part Number: RC1206FR-071K33L; RoHS: Compliant; Category: Chip SMD Resistors; Stock: 40191; Pricing: 1=0.1, 10=0.047, 25=0.036, 50=0.0296, 100=0.0247, 250=0.0198, 500=0.01698, 1000=0.01477 (USD); Case/Package: 1206; Case Code (Imperial): 1206; Case Code (Metric): 3216; China RoHS: Non-Compliant; Composition: Thick Film; Country of Origin: Mainland China, Taiwan; Depth: 1.6mm; Export Control Classification Number (ECCN) Code: EAR99; Height: 550µm; Harmonized Tariff Schedule (HTS) Code: 8533.21.00.30; Introduction Date: 2004-09-22; Lead Free: Lead Free; Length: 3.1mm; Lifecycle Status: Production; Max Operating Temperature: 155°C; Military Standard: Not; Min Operating Temperature: -55°C; Mounting Technology: Surface Mount; Number of Terminals: 2; Packaging: Tape & Reel; REACH SVHC: Yes; Value: 1.33kΩ; Schedule B: 8533210045, 8533210045|8533210045, 8533210045|8533210045|8533210045, 8533210045|8533210045|8533210045|8533210045; Termination: SMD/SMT; Tolerance: 1%; Voltage Rating (DC): 200V; Width: 1.6mm; Working Voltage: 200V; ComponentLink1URL: https://datasheet.octopart.com:443/RC1206FR-071K33L-Yageo-datasheet-175887523.pdf?src-supplier=IHS; ComponentLink1Description: https://datasheet.octopart.com:443/RC1206FR-071K33L-Yageo-datasheet-175887523.pdf?src-supplier=IHS; ComponentLink2URL: https://datasheet.octopart.com:443/RC1206FR-071K33L-Yageo-datasheet-103092701.pdf?src-supplier=Upverter; ComponentLink2Description: https://datasheet.octopart.com:443/RC1206FR-071K33L-Yageo-datasheet-103092701.pdf?src-supplier=Upverter; ComponentLink3URL: https://datasheet.octopart.com:443/RC1206FR-071K33L-Yageo-datasheet-176638170.pdf?src-supplier=Future+Electronics; ComponentLink3Description: https://datasheet.octopart.com:443/RC1206FR-071K33L-Yageo-datasheet-176638170.pdf?src-supplier=Future+Electronics; ComponentLink4URL: https://datasheet.octopart.com:443/RC1206FR-071K33L-Yageo-datasheet-8359522.pdf?src-supplier=Future+Electronics; ComponentLink4Description: https://datasheet.octopart.com:443/RC1206FR-071K33L-Yageo-datasheet-8359522.pdf?src-supplier=Future+Electronics; ComponentLink5URL: https://datasheet.octopart.com:443/RC1206FR-071K33L-Yageo-datasheet-164759695.pdf?src-supplier=Future+Electronics; ComponentLink5Description: https://datasheet.octopart.com:443/RC1206FR-071K33L-Yageo-datasheet-164759695.pdf?src-supplier=Future+Electronics; ComponentLink6URL: https://datasheet.octopart.com:443/RC1206FR-071K33L-Yageo-datasheet-137700087.pdf?src-supplier=Future+Electronics; ComponentLink6Description: https://datasheet.octopart.com:443/RC1206FR-071K33L-Yageo-datasheet-137700087.pdf?src-supplier=Future+Electronics; ComponentLink7URL: https://datasheet.octopart.com:443/RC1206FR-071K33L-Yageo-datasheet-27233761.pdf?src-supplier=Future+Electronics; ComponentLink7Description: https://datasheet.octopart.com:443/RC1206FR-071K33L-Yageo-datasheet-27233761.pdf?src-supplier=Future+Electronics; ComponentLink8URL: https://datasheet.octopart.com:443/RC1206FR-071K33L-Yageo-datasheet-13032847.pdf?src-supplier=Future+Electronics; ComponentLink8Description: https://datasheet.octopart.com:443/RC1206FR-071K33L-Yageo-datasheet-13032847.pdf?src-supplier=Future+Electronics; ComponentLink9URL: https://datasheet.octopart.com/RC1206FR-071K33L-Yageo-datasheet-73766026.pdf; ComponentLink9Description: https://datasheet.octopart.com/RC1206FR-071K33L-Yageo-datasheet-73766026.pdf; ComponentLink10URL: https://datasheet.octopart.com:443/RC1206FR-071K33L-Yageo-datasheet-118639.pdf?src-supplier=DigiKey; ComponentLink10Description: https://datasheet.octopart.com:443/RC1206FR-071K33L-Yageo-datasheet-118639.pdf?src-supplier=DigiKey; ComponentLink11URL: http://sigma.octopart.com:80/conflict_mineral_statement/Yageo-company-3.pdf?src-supplier=Compliance+Statements; ComponentLink11Description: http://sigma.octopart.com:80/conflict_mineral_statement/Yageo-company-3.pdf?src-supplier=Compliance+Statements; ComponentLink12URL: http://sigma.octopart.com:80/rohs_statement/Yageo-company-2.pdf?src-supplier=Compliance+Statements; ComponentLink12Description: http://sigma.octopart.com:80/rohs_statement/Yageo-company-2.pdf?src-supplier=Compliance+Statements
R106 R112 = RC0805FR-0715RL: RES 15 OHM 1% 1/8W 0805; Manufacturer: Yageo Group; Max Power Dissipation: 125mW; Temperature Coefficient: 100ppm/°C; Voltage Rating: 150V; Supplier: DigiKey; Supplier Part Number: 311-15.0CRCT-ND; Manufacturer Part Number: RC0805FR-0715RL; RoHS: Compliant; Category: Chip SMD Resistors; Stock: 34767; Pricing: 1=0.13, 10=0.010, 25=0.0096, 50=0.0092, 100=0.0083 (USD); Case/Package: 0805; Case Code (Imperial): 0805; China RoHS: Non-Compliant; Composition: Thick Film; Country of Origin: Mainland China, Taiwan; Depth: 1.25mm; Export Control Classification Number (ECCN) Code: EAR99; Features: Moisture Resistant; Height: 500µm; Harmonized Tariff Schedule (HTS) Code: 8533.21.00.30; Introduction Date: 2004-09-22; Lead Free: Lead Free; Length: 2mm; Lifecycle Status: Production; Max Operating Temperature: 155°C; Military Standard: Not; Min Operating Temperature: -55°C; Mounting Technology: Surface Mount; Pins: 2; Number of Terminals: 2; Number of Terminations: 2; Power Dissipation: 125mW; Power Rating: 125mW; REACH SVHC: Yes; Value: 15Ω; Schedule B: 8533210045, 8533210045|8533210045, 8533210045|8533210045|8533210045, 8533210045|8533210045|8533210045|8533210045; Termination: SMD/SMT; Tolerance: 1%; Voltage Rating (AC): 150V; Voltage Rating (DC): 150V; Width: 1.25mm; Working Voltage: 150V; ComponentLink1URL: https://datasheet.octopart.com:443/RC0805FR-0715RL-Yageo-datasheet-175887523.pdf?src-supplier=Newark; ComponentLink1Description: https://datasheet.octopart.com:443/RC0805FR-0715RL-Yageo-datasheet-175887523.pdf?src-supplier=Newark; ComponentLink2URL: https://datasheet.octopart.com:443/RC0805FR-0715RL-Yageo-datasheet-103092701.pdf?src-supplier=Upverter; ComponentLink2Description: https://datasheet.octopart.com:443/RC0805FR-0715RL-Yageo-datasheet-103092701.pdf?src-supplier=Upverter; ComponentLink3URL: https://datasheet.octopart.com:443/RC0805FR-0715RL-Yageo-Group-datasheet-190305687.pdf?src-supplier=Future+Electronics; ComponentLink3Description: https://datasheet.octopart.com:443/RC0805FR-0715RL-Yageo-Group-datasheet-190305687.pdf?src-supplier=Future+Electronics; ComponentLink4URL: https://datasheet.octopart.com:443/RC0805FR-0715RL-Yageo-datasheet-164759695.pdf?src-supplier=Future+Electronics; ComponentLink4Description: https://datasheet.octopart.com:443/RC0805FR-0715RL-Yageo-datasheet-164759695.pdf?src-supplier=Future+Electronics; ComponentLink5URL: https://datasheet.octopart.com:443/RC0805FR-0715RL-Yageo-datasheet-127823281.pdf?src-supplier=Future+Electronics; ComponentLink5Description: https://datasheet.octopart.com:443/RC0805FR-0715RL-Yageo-datasheet-127823281.pdf?src-supplier=Future+Electronics; ComponentLink6URL: https://datasheet.octopart.com:443/RC0805FR-0715RL-Yageo-datasheet-137700087.pdf?src-supplier=Future+Electronics; ComponentLink6Description: https://datasheet.octopart.com:443/RC0805FR-0715RL-Yageo-datasheet-137700087.pdf?src-supplier=Future+Electronics; ComponentLink7URL: https://datasheet.octopart.com:443/RC0805FR-0715RL-Yageo-datasheet-12592811.pdf?src-supplier=Future+Electronics; ComponentLink7Description: https://datasheet.octopart.com:443/RC0805FR-0715RL-Yageo-datasheet-12592811.pdf?src-supplier=Future+Electronics; ComponentLink8URL: https://datasheet.octopart.com:443/RC0805FR-0715RL-Yageo-datasheet-8324252.pdf?src-supplier=Future+Electronics; ComponentLink8Description: https://datasheet.octopart.com:443/RC0805FR-0715RL-Yageo-datasheet-8324252.pdf?src-supplier=Future+Electronics; ComponentLink9URL: https://datasheet.octopart.com:443/RC0805FR-0715RL-Yageo-datasheet-8330313.pdf?src-supplier=element14+APAC; ComponentLink9Description: https://datasheet.octopart.com:443/RC0805FR-0715RL-Yageo-datasheet-8330313.pdf?src-supplier=element14+APAC; ComponentLink10URL: https://datasheet.octopart.com:443/RC0805FR-0715RL-Yageo-datasheet-62067350.pdf?src-supplier=element14+APAC; ComponentLink10Description: https://datasheet.octopart.com:443/RC0805FR-0715RL-Yageo-datasheet-62067350.pdf?src-supplier=element14+APAC; ComponentLink11URL: https://datasheet.octopart.com:443/RC0805FR-0715RL-Yageo-datasheet-148775077.pdf?src-supplier=TME; ComponentLink11Description: https://datasheet.octopart.com:443/RC0805FR-0715RL-Yageo-datasheet-148775077.pdf?src-supplier=TME; ComponentLink12URL: https://datasheet.octopart.com/RC0805FR-0715RL-Yageo-datasheet-73766026.pdf; ComponentLink12Description: https://datasheet.octopart.com/RC0805FR-0715RL-Yageo-datasheet-73766026.pdf; ComponentLink13URL: https://datasheet.octopart.com:443/RC0805FR-0715RL-Yageo-datasheet-13691069.pdf?src-supplier=Farnell; ComponentLink13Description: https://datasheet.octopart.com:443/RC0805FR-0715RL-Yageo-datasheet-13691069.pdf?src-supplier=Farnell; ComponentLink14URL: https://datasheet.octopart.com:443/RC0805FR-0715RL-Yageo-datasheet-118657.pdf?src-supplier=DigiKey; ComponentLink14Description: https://datasheet.octopart.com:443/RC0805FR-0715RL-Yageo-datasheet-118657.pdf?src-supplier=DigiKey; ComponentLink15URL: http://sigma.octopart.com:80/conflict_mineral_statement/Yageo-company-3.pdf?src-supplier=Compliance+Statements; ComponentLink15Description: http://sigma.octopart.com:80/conflict_mineral_statement/Yageo-company-3.pdf?src-supplier=Compliance+Statements; ComponentLink16URL: http://sigma.octopart.com:80/rohs_statement/Yageo-company-2.pdf?src-supplier=Compliance+Statements; ComponentLink16Description: http://sigma.octopart.com:80/rohs_statement/Yageo-company-2.pdf?src-supplier=Compliance+Statements
R107 = RC1206FR-0759RL: RES 59 OHM 1% 1/4W 1206; Manufacturer: Yageo Group; Max Power Dissipation: 250mW; Temperature Coefficient: 100ppm/°C; Voltage Rating: 200V; Supplier: DigiKey; Supplier Part Number: 311-59.0FRCT-ND; Manufacturer Part Number: RC1206FR-0759RL; RoHS: Compliant; Category: Chip SMD Resistors; Stock: 29541; Pricing: 1=0.1, 10=0.047, 25=0.036, 50=0.0296, 100=0.0247, 250=0.0198, 500=0.01698, 1000=0.01477 (USD); Case/Package: 1206; Case Code (Imperial): 1206; Case Code (Metric): 3216; China RoHS: Non-Compliant; Composition: Thick Film; Country of Origin: Mainland China, Taiwan; Depth: 1.6mm; Export Control Classification Number (ECCN) Code: EAR99; Features: Moisture Resistant; Height: 550µm; Harmonized Tariff Schedule (HTS) Code: 8533.21.00.30; Introduction Date: 2004-09-22; Lead Free: Lead Free; Length: 3.1mm; Lifecycle Status: Production; Max Operating Temperature: 155°C; Military Standard: Not; Min Operating Temperature: -55°C; Mounting Technology: Surface Mount; Number of Terminals: 2; Number of Terminations: 2; Power Rating: 250mW; REACH SVHC: Yes; Value: 59Ω; Schedule B: 8533210045, 8533210045|8533210045|8533210045|8533210045|8533210045; Termination: SMD/SMT; Tolerance: 1%; Voltage Rating (DC): 200V; Width: 1.6mm; Working Voltage: 200V; ComponentLink1URL: https://datasheet.octopart.com:443/RC1206FR-0759RL-Yageo-datasheet-175887523.pdf?src-supplier=IHS; ComponentLink1Description: https://datasheet.octopart.com:443/RC1206FR-0759RL-Yageo-datasheet-175887523.pdf?src-supplier=IHS; ComponentLink2URL: https://datasheet.octopart.com:443/RC1206FR-0759RL-Yageo-datasheet-103092701.pdf?src-supplier=Upverter; ComponentLink2Description: https://datasheet.octopart.com:443/RC1206FR-0759RL-Yageo-datasheet-103092701.pdf?src-supplier=Upverter; ComponentLink3URL: https://datasheet.octopart.com:443/RC1206FR-0759RL-Yageo-Group-datasheet-176638170.pdf?src-supplier=Future+Electronics; ComponentLink3Description: https://datasheet.octopart.com:443/RC1206FR-0759RL-Yageo-Group-datasheet-176638170.pdf?src-supplier=Future+Electronics; ComponentLink4URL: https://datasheet.octopart.com:443/RC1206FR-0759RL-Yageo-datasheet-164759695.pdf?src-supplier=Future+Electronics; ComponentLink4Description: https://datasheet.octopart.com:443/RC1206FR-0759RL-Yageo-datasheet-164759695.pdf?src-supplier=Future+Electronics; ComponentLink5URL: https://datasheet.octopart.com:443/RC1206FR-0759RL-Yageo-datasheet-127823281.pdf?src-supplier=Future+Electronics; ComponentLink5Description: https://datasheet.octopart.com:443/RC1206FR-0759RL-Yageo-datasheet-127823281.pdf?src-supplier=Future+Electronics; ComponentLink6URL: https://datasheet.octopart.com:443/RC1206FR-0759RL-Yageo-datasheet-137700087.pdf?src-supplier=Future+Electronics; ComponentLink6Description: https://datasheet.octopart.com:443/RC1206FR-0759RL-Yageo-datasheet-137700087.pdf?src-supplier=Future+Electronics; ComponentLink7URL: https://datasheet.octopart.com:443/RC1206FR-0759RL-Yageo-datasheet-27233761.pdf?src-supplier=Future+Electronics; ComponentLink7Description: https://datasheet.octopart.com:443/RC1206FR-0759RL-Yageo-datasheet-27233761.pdf?src-supplier=Future+Electronics; ComponentLink8URL: https://datasheet.octopart.com:443/RC1206FR-0759RL-Yageo-datasheet-13032847.pdf?src-supplier=Future+Electronics; ComponentLink8Description: https://datasheet.octopart.com:443/RC1206FR-0759RL-Yageo-datasheet-13032847.pdf?src-supplier=Future+Electronics; ComponentLink9URL: https://datasheet.octopart.com:443/RC1206FR-0759RL-Yageo-datasheet-8359522.pdf?src-supplier=Future+Electronics; ComponentLink9Description: https://datasheet.octopart.com:443/RC1206FR-0759RL-Yageo-datasheet-8359522.pdf?src-supplier=Future+Electronics; ComponentLink10URL: https://datasheet.octopart.com/RC1206FR-0759RL-Yageo-datasheet-73766026.pdf; ComponentLink10Description: https://datasheet.octopart.com/RC1206FR-0759RL-Yageo-datasheet-73766026.pdf; ComponentLink11URL: https://datasheet.octopart.com:443/RC1206FR-0759RL-Yageo-datasheet-118639.pdf?src-supplier=DigiKey; ComponentLink11Description: https://datasheet.octopart.com:443/RC1206FR-0759RL-Yageo-datasheet-118639.pdf?src-supplier=DigiKey; ComponentLink12URL: http://sigma.octopart.com:80/conflict_mineral_statement/Yageo-company-3.pdf?src-supplier=Compliance+Statements; ComponentLink12Description: http://sigma.octopart.com:80/conflict_mineral_statement/Yageo-company-3.pdf?src-supplier=Compliance+Statements; ComponentLink13URL: http://sigma.octopart.com:80/rohs_statement/Yageo-company-2.pdf?src-supplier=Compliance+Statements; ComponentLink13Description: http://sigma.octopart.com:80/rohs_statement/Yageo-company-2.pdf?src-supplier=Compliance+Statements